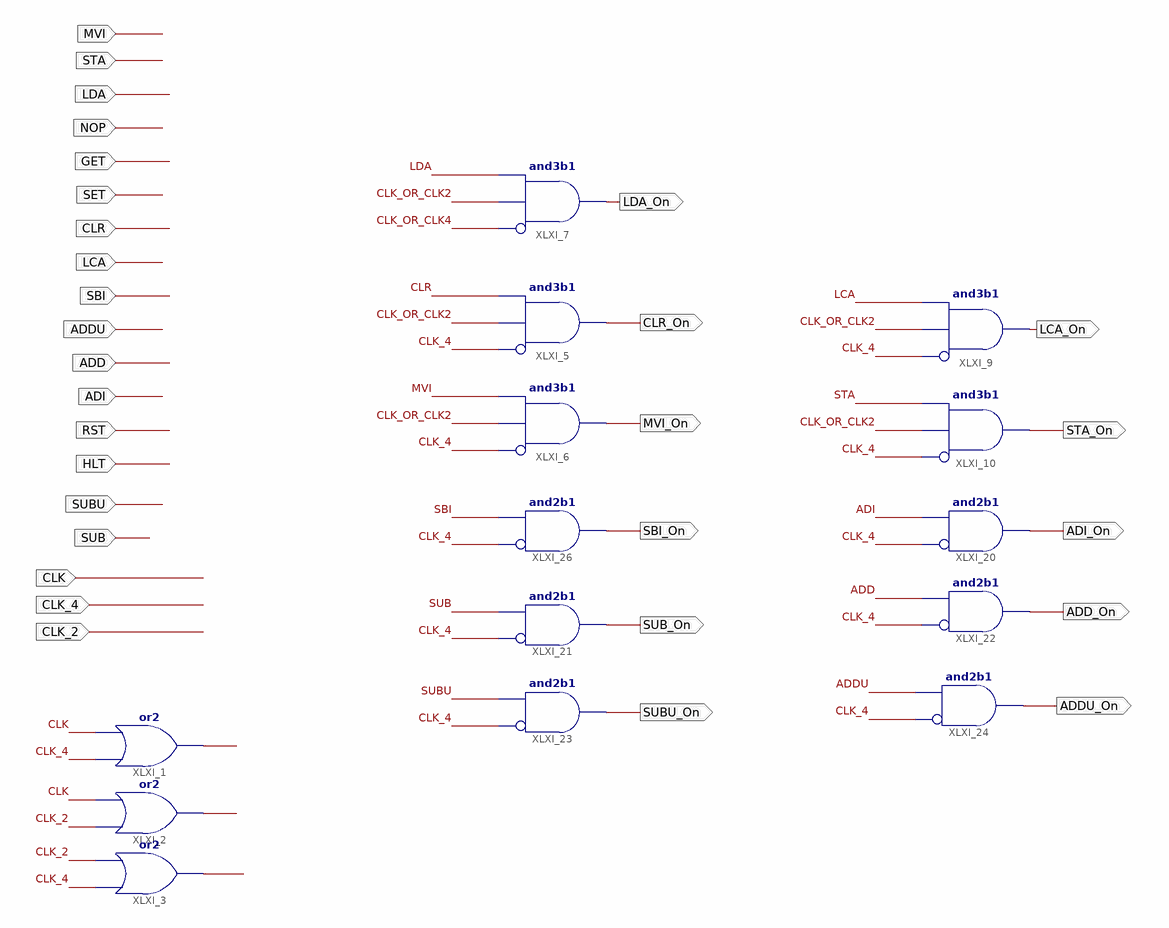
[diagram p0: schematic sheet 1]
// Xilinx ISE schematic ClockSignalController.sch (spartan3e) as structural Verilog: 14 symbols, 30 ports
module ClockSignalController (
  input  MVI,
  input  STA,
  input  LDA,
  input  NOP,
  input  GET,
  input  SET,
  input  CLR,
  input  LCA,
  input  SBI,
  input  ADDU,
  input  ADD,
  input  ADI,
  input  RST,
  input  HLT,
  input  SUBU,
  input  SUB,
  input  CLK,
  input  CLK_4,
  input  CLK_2,
  output CLR_On,
  output MVI_On,
  output LCA_On,
  output STA_On,
  output ADI_On,
  output SUB_On,
  output ADD_On,
  output SUBU_On,
  output ADDU_On,
  output SBI_On,
  output LDA_On
);

  wire CLK2_OR_CLK4, CLK_OR_CLK2, CLK_OR_CLK4;

  and XLXI_5 (CLR_On, ~CLK_4, CLK_OR_CLK2, CLR);  // and3b1
  and XLXI_6 (MVI_On, ~CLK_4, CLK_OR_CLK2, MVI);  // and3b1
  and XLXI_9 (LCA_On, ~CLK_4, CLK_OR_CLK2, LCA);  // and3b1
  and XLXI_10 (STA_On, ~CLK_4, CLK_OR_CLK2, STA);  // and3b1
  and XLXI_20 (ADI_On, ~CLK_4, ADI);  // and2b1
  and XLXI_21 (SUB_On, ~CLK_4, SUB);  // and2b1
  and XLXI_22 (ADD_On, ~CLK_4, ADD);  // and2b1
  and XLXI_23 (SUBU_On, ~CLK_4, SUBU);  // and2b1
  and XLXI_24 (ADDU_On, ~CLK_4, ADDU);  // and2b1
  and XLXI_26 (SBI_On, ~CLK_4, SBI);  // and2b1
  and XLXI_7 (LDA_On, ~CLK_OR_CLK4, CLK_OR_CLK2, LDA);  // and3b1
  or XLXI_1 (CLK_OR_CLK4, CLK_4, CLK);
  or XLXI_2 (CLK_OR_CLK2, CLK_2, CLK);
  or XLXI_3 (CLK2_OR_CLK4, CLK_4, CLK_2);
endmodule
